# EAGLE design STM32_CAN-USB (EAGLE 7.2.0)
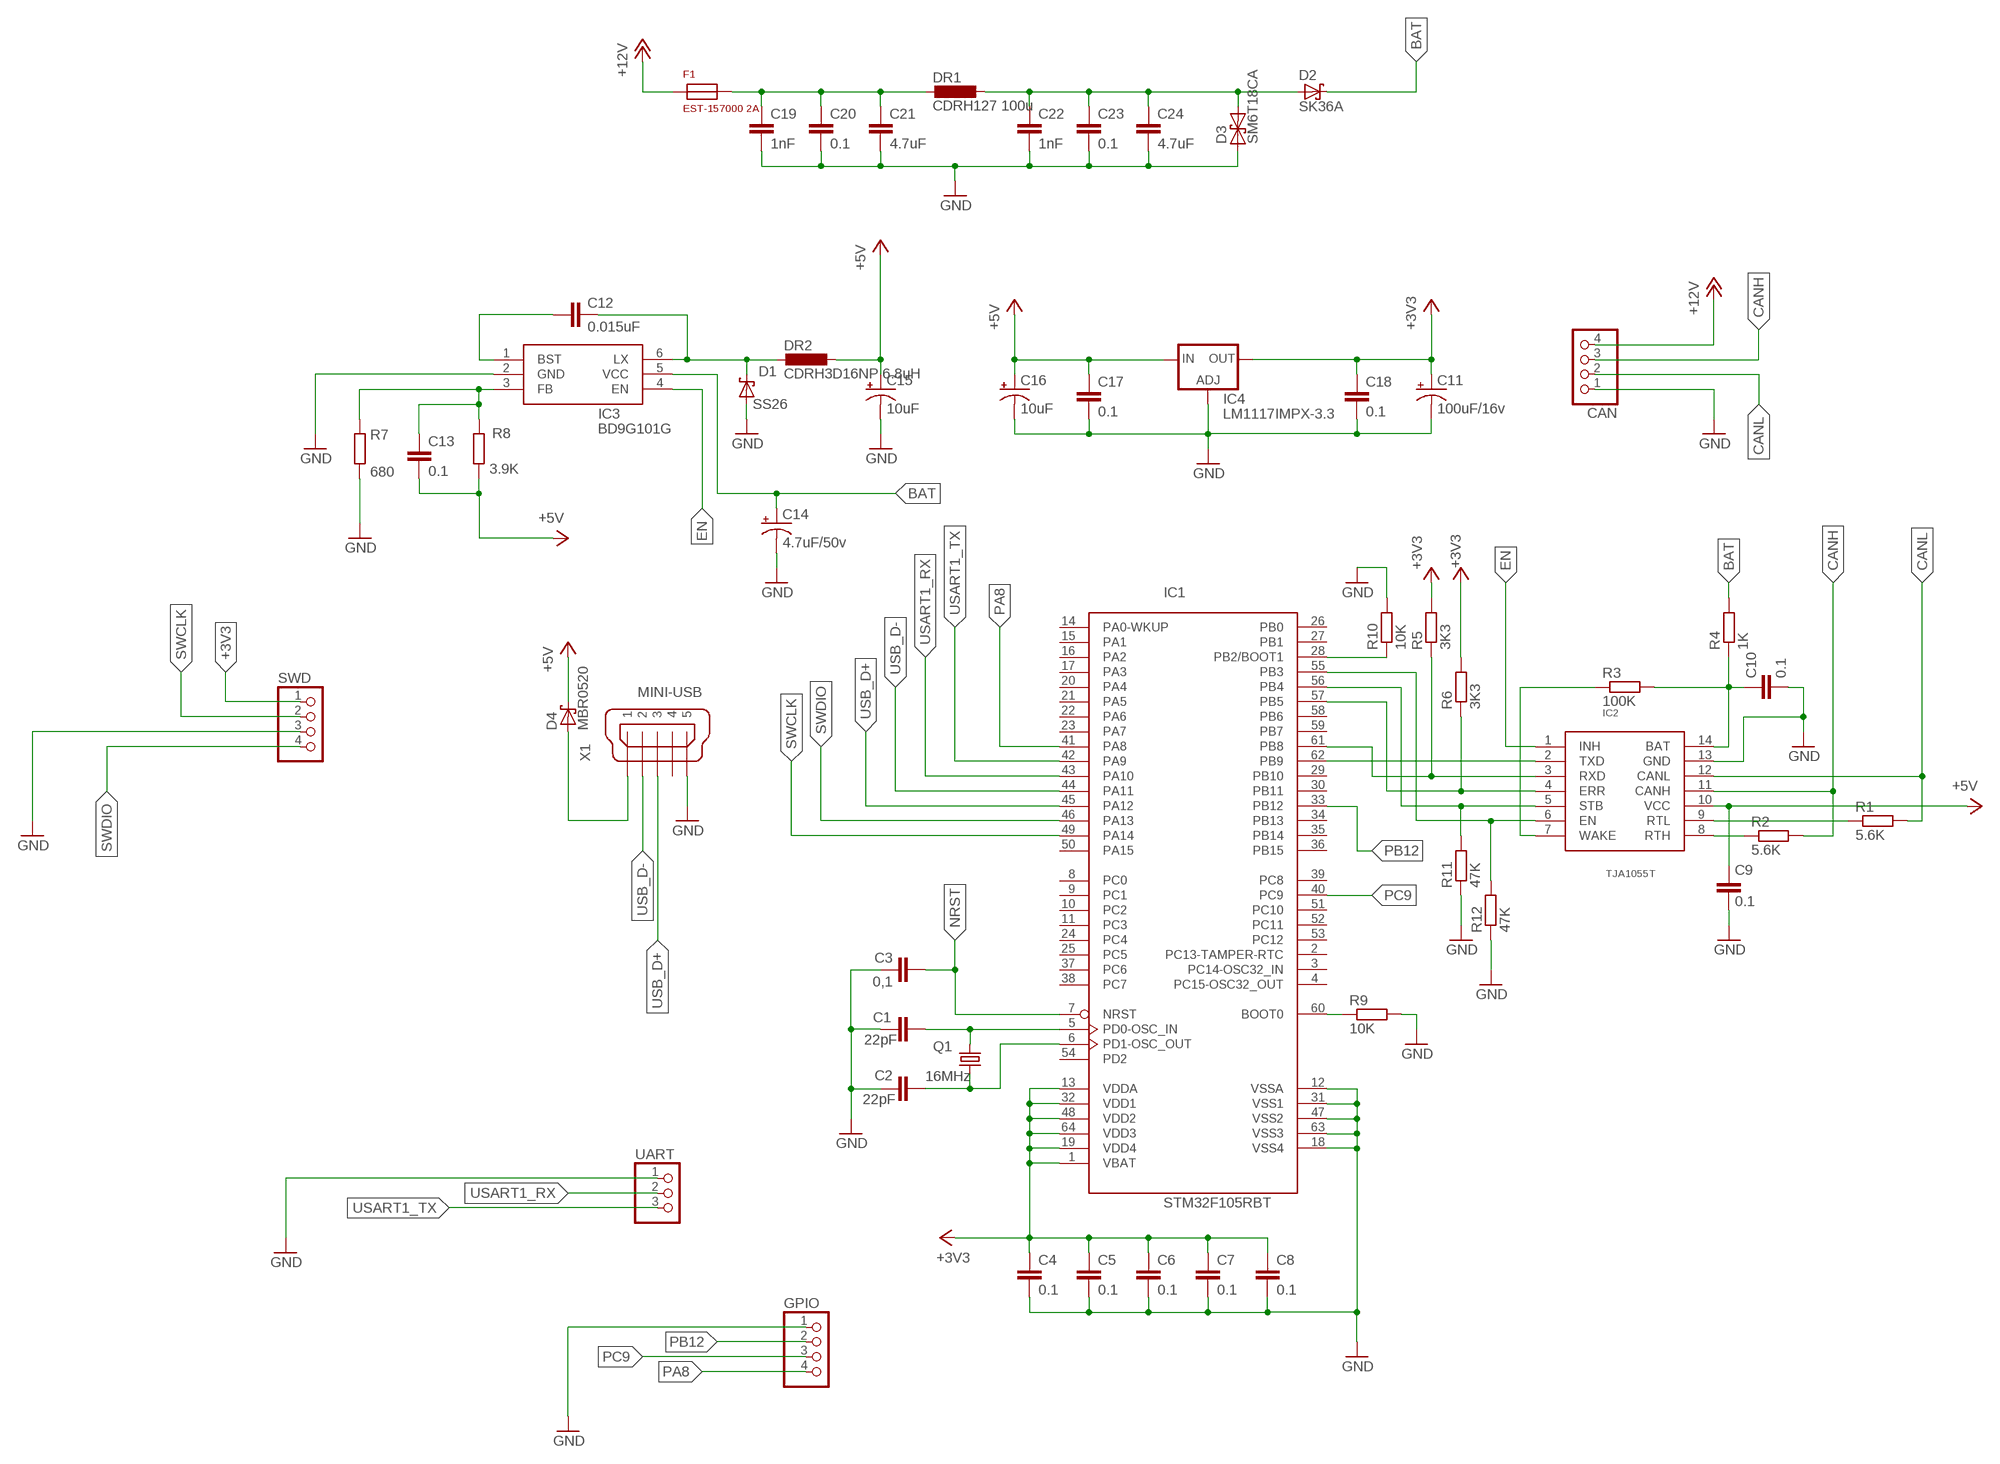
[diagram p0: schematic, sheet 1]

## Parts
C1  22pF  C-EUC0805  [C0805]
C2  22pF  C-EUC0805  [C0805]
C3  0,1  C-EUC0805  [C0805]
C4  0.1  C-EUC0805  [C0805]
C5  0.1  C-EUC0805  [C0805]
C6  0.1  C-EUC0805  [C0805]
C7  0.1  C-EUC0805  [C0805]
C8  0.1  C-EUC0805  [C0805]
C9  0.1  C-EUC0805  [C0805]
C10  0.1  C-EUC0805  [C0805]
C11  100uF/16v  CPOL-US153CLV-0605  [153CLV-0605]
C12  0.015uF  C-EUC0805  [C0805]
C13  0.1  C-EUC0805  [C0805]
C14  4.7uF/50v  CPOL-US153CLV-0605  [153CLV-0605]
C15  10uF  CPOL-US153CLV-0605  [153CLV-0605]
C16  10uF  CPOL-US153CLV-0605  [153CLV-0605]
C17  0.1  C-EUC0805  [C0805]
C18  0.1  C-EUC0805  [C0805]
C19  1nF  C-EUC0805  [C0805]
C20  0.1  C-EUC0805  [C0805]
C21  4.7uF  C-EUC0805  [C0805]
C22  1nF  C-EUC0805  [C0805]
C23  0.1  C-EUC0805  [C0805]
C24  4.7uF  C-EUC0805  [C0805]
CAN  PINHD-1X4  [1X04]
D1  SS26  SCHOTTKY-DIODESMD  [SMB]
D2  SK36A  [DO-214AC]
D3  SM6T18CA  [DO214AA]
D4  MBR0520  [SOD123]
DR1  CDRH127 100u  CDRH127  [MS85]
DR2  CDRH3D16NP 6.8uH  CDRH3D16NP  [CDRH3D16NP]
F1  EST-157000 2A  FUSE  [FUSE]
GPIO  PINHD-1X4  [1X04]
IC1  STM32F105RBT  [LQFP64]
IC2  TJA1055T  TJA1054T  [SO-14W]
IC3  BD9G101G  [SSOP6]
IC4  LM1117IMPX-3.3  [SOT223]
Q1  16MHz  CRYSTALHC49UP  [HC49UP]
R1  5.6K  R-EU_R0805  [R0805]
R2  5.6K  R-EU_R0805  [R0805]
R3  100K  R-EU_R0805  [R0805]
R4  1K  R-EU_R0805  [R0805]
R5  3K3  R-EU_R0805  [R0805]
R6  3K3  R-EU_R0805  [R0805]
R7  680  R-EU_R0805  [R0805]
R8  3.9K  R-EU_R0805  [R0805]
R9  10K  R-EU_R0805  [R0805]
R10  10K  R-EU_R0805  [R0805]
R11  47K  R-EU_R0805  [R0805]
R12  47K  R-EU_R0805  [R0805]
SWD  PINHD-1X4  [1X04]
UART  PINHD-1X3  [1X03]
X1  MINI-USB  MINI-USB-UX60-MB-5ST  [UX60-MB-5ST]

## Nets
+3V3: C4.1 C5.1 C6.1 C7.1 C8.1 C11.+ C18.1 IC1.1(VBAT) IC1.13(VDDA) IC1.19(VDD4) IC1.32(VDD1) IC1.48(VDD2) IC1.64(VDD3) IC4.2(OUT) IC4.4(OUT) R5.2 R6.2 SWD.1
+5V: C9.1 C13.2 C15.+ C16.+ C17.1 D4.C DR2.P$2 IC2.10(VCC) IC4.3(IN) R8.1
+12V: CAN.4 F1.P$1
BAT: C14.+ D2.C IC3.5(VCC) R4.2
CANH: CAN.3 IC2.11(CANH) R2.2
CANL: CAN.2 IC2.12(CANL) R1.2
EN: IC2.1(INH) IC3.4(EN)
GND: C1.2 C2.2 C3.1 C4.2 C5.2 C6.2 C7.2 C8.2 C9.2 C10.2 C11.- C14.- C15.- C16.- C17.2 C18.2 C19.2 C20.2 C21.2 C22.2 C23.2 C24.2 CAN.1 D1.A D3.A GPIO.1 IC1.12(VSSA) IC1.18(VSS4) IC1.31(VSS1) IC1.47(VSS2) IC1.63(VSS3) IC2.13(GND) IC3.2(GND) IC4.1(ADJ) R7.1 R9.2 R10.2 R11.1 R12.1 SWD.3 UART.1 X1.5 X1.M1 X1.M2
N$1: C1.1 IC1.5(PD0-OSC_IN) Q1.2
N$2: C2.1 IC1.6(PD1-OSC_OUT) Q1.1
N$3: IC1.60(BOOT0) R9.1
N$4: IC1.61(PB8) IC2.3(RXD) R5.1
N$5: IC1.62(PB9) IC2.2(TXD)
N$6: IC1.56(PB4) IC2.5(STB) R11.2
N$7: IC2.8(RTH) R2.1
N$8: IC2.9(RTL) R1.1
N$9: C12.1 IC3.1(BST)
N$10: IC2.7(WAKE) R3.1
N$11: C10.1 IC2.14(BAT) R3.2 R4.1
N$12: C12.2 D1.C DR2.P$1 IC3.6(LX)
N$13: C13.1 IC3.3(FB) R7.2 R8.2
N$14: IC1.55(PB3) IC2.6(EN) R12.2
N$15: IC1.57(PB5) IC2.4(ERR) R6.1
N$16: IC1.28(PB2/BOOT1) R10.1
N$17: C22.1 C23.1 C24.1 D2.A D3.C DR1.P$2
N$18: C19.1 C20.1 C21.1 DR1.P$1 F1.P$2
N$19: D4.A X1.1
NRST: C3.2 IC1.7(NRST)
PA8: GPIO.4 IC1.41(PA8)
PB12: GPIO.2 IC1.33(PB12)
PC9: GPIO.3 IC1.40(PC9)
SWCLK: IC1.49(PA14) SWD.2
SWDIO: IC1.46(PA13) SWD.4
USART1_RX: IC1.43(PA10) UART.2
USART1_TX: IC1.42(PA9) UART.3
USB_D+: IC1.45(PA12) X1.3
USB_D-: IC1.44(PA11) X1.2
Unconnected: IC1.2(PC13-TAMPER-RTC) IC1.3(PC14-OSC32_IN) IC1.4(PC15-OSC32_OUT) IC1.8(PC0) IC1.9(PC1) IC1.10(PC2) IC1.11(PC3) IC1.14(PA0-WKUP) IC1.15(PA1) IC1.16(PA2) IC1.17(PA3) IC1.20(PA4) IC1.21(PA5) IC1.22(PA6) IC1.23(PA7) IC1.24(PC4) IC1.25(PC5) IC1.26(PB0) IC1.27(PB1) IC1.29(PB10) IC1.30(PB11) IC1.34(PB13) IC1.35(PB14) IC1.36(PB15) IC1.37(PC6) IC1.38(PC7) IC1.39(PC8) IC1.50(PA15) IC1.51(PC10) IC1.52(PC11) IC1.53(PC12) IC1.54(PD2) IC1.58(PB6) IC1.59(PB7) X1.4

## Library data of the parts
C1-C10 C12 C13 C17-C24 = rcl:C-EU: CAPACITOR, European symbol
C11 C14-C16 = rcl:CPOL-US: POLARIZED CAPACITOR, American symbol
CAN GPIO SWD = pinhead:PINHD-1X4: PIN HEADER
D1 = STM32_CAN-USB:SCHOTTKY-DIODE: Schottky Diode
D2 = STM32_CAN-USB:SK36A
D3 = STM32_CAN-USB:SM6T18CA
D4 = STM32_CAN-USB:MBR0520
DR1 = STM32_CAN-USB:CDRH127
DR2 = STM32_CAN-USB:CDRH3D16NP
F1 = STM32_CAN-USB:FUSE
IC1 = STM32_CAN-USB:STM32F105R*T: ARM 32-bit Cortex™-M3 CPU 72 MHz maximum frequency 64 to 256 Kbytes of Flash memory 64 kbytes of SRAM 51 GPIOs 2.0 to 3.6 V application supply
IC2 = STM32_CAN-USB:TJA1054T
IC3 = STM32_CAN-USB:BD9G101G
IC4 = STM32_CAN-USB:LM1117IMPX-3.3
Q1 = crystal:CRYSTAL: CRYSTAL; OC_FARNELL: unknown; OC_NEWARK: unknown
R1-R12 = rcl:R-EU_: RESISTOR, European symbol
UART = pinhead:PINHD-1X3: PIN HEADER
X1 = STM32_CAN-USB:MINI-USB-: MINI USB Connector Source: http://www.hirose.co.jp/cataloge_hp/e24000019.pdf; OC_FARNELL: unknown; OC_NEWARK: unknown

## Board
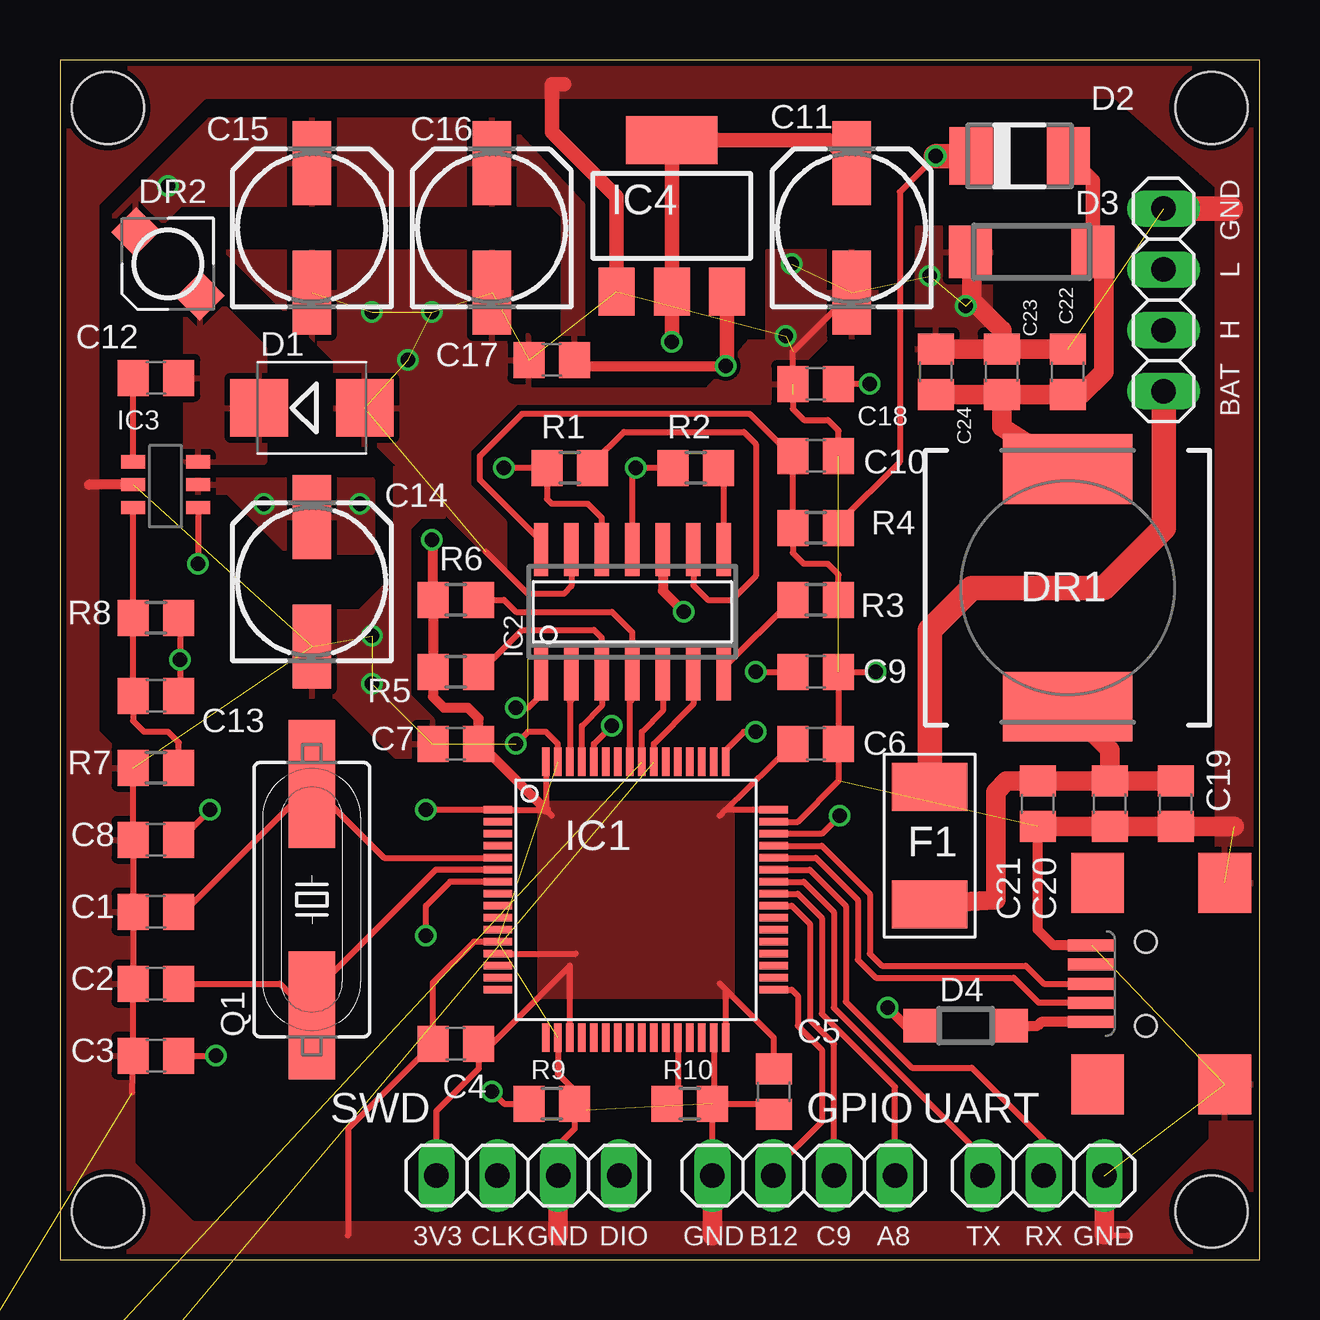
[diagram p1: board, top side]
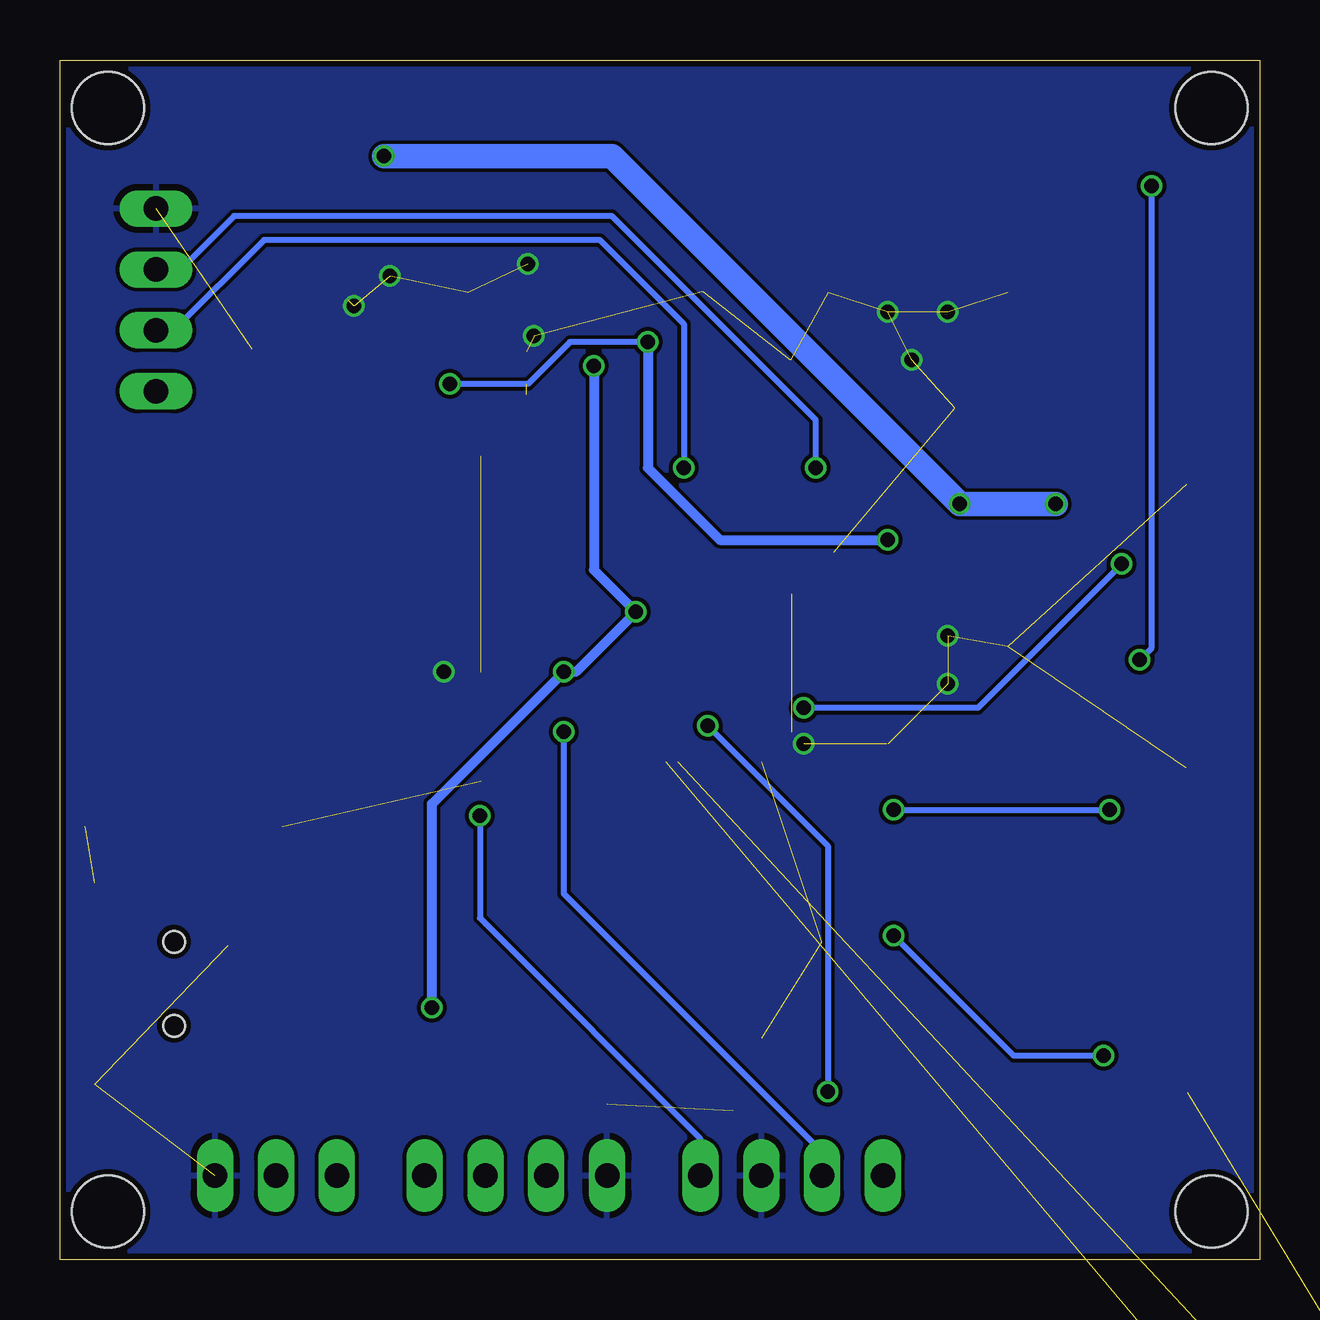
[diagram p2: board, bottom side, seen from below]

Size 50 x 50 mm. Coordinates in mm from the lower left corner, seen from the top.
Outline: 0,0 50,0 50,50 0,50 0,0
Copper layers (1*16): Top 0.035mm / dielectric 1.5mm / Bottom 0.035mm
Design rules "ITEADstudio_DRC": minimum track width 6mil, minimum drill 12mil, track to track 6mil, track to pad 6mil, pad to pad 6mil, via to via 6mil, smd to smd 0mil, copper to edge 10mil, drill to drill 10mil, minimum pad ring 10mil, minimum via ring 6mil, stop-mask expansion 2mil, vias tented up to drill 100mil, thermal gap 10mil
Holes 3 mm at 2,2 2,48 48,48 48,2

### Footprints (pad centres in the part's own frame; a part is rotated, then mirrored left to right if it is on the bottom)
C0805 = smd 1.3 x 1.5: 1 -0.95,0; 2 0.95,0
153CLV-0605 = smd 3.5 x 1.6: + 2.7,0; - -2.7,0
1X04 = drill 1.016 long: 1 -3.81,0; 2 -1.27,0; 3 1.27,0; 4 3.81,0
SMB = smd 2.4 x 2.4: A 2.2,0; C -2.2,0
DO-214AC = smd 1.8 x 2.4: A 2.025,0; C -2.025,0
DO214AA = smd 1.8 x 2.2: A 2.55,0; C -2.55,0
SOD123 = smd 1.4 x 1.4: A 1.9,0; C -1.9,0
MS85 = smd 5.4 x 2.9: P$1 0,4.95; P$2 0,-4.95
CDRH3D16NP = smd 1.5 x 1.4 rotated 45: P$1 -1.349,1.349; P$2 1.349,-1.349
FUSE = smd 2 x 3.15: P$1 -2.45,0; P$2 2.45,0
LQFP64 = smd 1.2 x 0.3: 1 -5.75,3.75; 2 -5.75,3.25; 3 -5.75,2.75; 4 -5.75,2.25; 5 -5.75,1.75; 6 -5.75,1.25; 7 -5.75,0.75; 8 -5.75,0.25; 9 -5.75,-0.25; 10 -5.75,-0.75; 11 -5.75,-1.25; 12 -5.75,-1.75; 13 -5.75,-2.25; 14 -5.75,-2.75; 15 -5.75,-3.25; 16 -5.75,-3.75; 33 5.75,-3.75; 34 5.75,-3.25; 35 5.75,-2.75; 36 5.75,-2.25; 37 5.75,-1.75; 38 5.75,-1.25; 39 5.75,-0.75; 40 5.75,-0.25; 41 5.75,0.25; 42 5.75,0.75; 43 5.75,1.25; 44 5.75,1.75; 45 5.75,2.25; 46 5.75,2.75; 47 5.75,3.25; 48 5.75,3.75 | smd 0.3 x 1.2: 17 -3.75,-5.75; 18 -3.25,-5.75; 19 -2.75,-5.75; 20 -2.25,-5.75; 21 -1.75,-5.75; 22 -1.25,-5.75; 23 -0.75,-5.75; 24 -0.25,-5.75; 25 0.25,-5.75; 26 0.75,-5.75; 27 1.25,-5.75; 28 1.75,-5.75; 29 2.25,-5.75; 30 2.75,-5.75; 31 3.25,-5.75; 32 3.75,-5.75; 49 3.75,5.75; 50 3.25,5.75; 51 2.75,5.75; 52 2.25,5.75; 53 1.75,5.75; 54 1.25,5.75; 55 0.75,5.75; 56 0.25,5.75; 57 -0.25,5.75; 58 -0.75,5.75; 59 -1.25,5.75; 60 -1.75,5.75; 61 -2.25,5.75; 62 -2.75,5.75; 63 -3.25,5.75; 64 -3.75,5.75
SO-14W = smd 0.6 x 2.2: 1 -3.81,-2.6; 2 -2.54,-2.6; 3 -1.27,-2.6; 4 0,-2.6; 5 1.27,-2.6; 6 2.54,-2.6; 7 3.81,-2.6; 8 3.81,2.6; 9 2.54,2.6; 10 1.27,2.6; 11 0,2.6; 12 -1.27,2.6; 13 -2.54,2.6; 14 -3.81,2.6
SSOP6 = smd 0.55 x 1: 1 0,-2.7; 2 0.95,-2.7; 3 1.9,-2.7; 4 1.9,0; 5 0.95,0; 6 0,0
SOT223 = smd 1.5 x 2: 1 -2.3,-3.15; 2 0,-3.15; 3 2.3,-3.15 | smd 3.8 x 2: 4 0,3.15
HC49UP = smd 5.334 x 1.93: 1 -4.826,0; 2 4.826,0
R0805 = smd 1.3 x 1.5: 1 -0.95,0; 2 0.95,0
1X03 = drill 1.016 long: 1 -2.54,0; 2 0,0; 3 2.54,0
UX60-MB-5ST = smd 2 x 0.5: 1 2.25,1.6; 2 2.25,0.8; 3 2.25,0; 4 2.25,-0.8; 5 2.25,-1.6 | smd 2.2 x 2.5: M1 -3.3,-4.2; M2 -3.3,4.2; M3 2,4.2; M4 2,-4.2 | hole 0.9: 0,-1.75; 0,1.75

### Placement (x,y rotation side)
C1  4,14.5 180 top
C2  4,11.5 180 top
C3  4,8.5 0 top
C4  16.5,9 180 top
C5  29.75,7 270 top
C6  31.5,21.5 0 top
C7  16.5,21.5 180 top
C8  4,17.5 180 top
C9  31.5,24.5 0 top
C10  31.5,33.5 0 top
C11  33,43 90 top
C12  4,36.75 0 top
C13  4,23.5 0 top
C14  10.5,28.25 90 top
C15  10.5,43 90 top
C16  18,43 90 top
C17  20.5,37.5 180 top
C18  31.5,36.5 180 top
C19  46.5,19 270 top
C20  43.75,19 270 top
C21  40.75,19 270 top
C22  42,37 90 top
C23  39.25,37 90 top
C24  36.5,37 90 top
CAN  46,40 270 top
D1  10.5,35.5 0 top
D2  40,46 0 top
D3  40.5,42 180 top
D4  37.75,9.75 0 top
DR1  42,28 180 top
DR2  4.5,41.5 180 top
F1  36.25,17.25 270 top
GPIO  31,3.5 0 top
IC1  24,15 0 top
IC2  23.86,27 0 top
IC3  5.75,33.25 270 top
IC4  25.5,43.5 0 top
Q1  10.5,15 90 top
R1  21.25,33 180 top
R2  26.5,33 180 top
R3  31.5,27.5 0 top
R4  31.5,30.5 0 top
R5  16.5,24.5 180 top
R6  16.5,27.5 180 top
R7  4,20.5 0 top
R8  4,26.75 180 top
R9  20.5,6.5 0 top
R10  26.25,6.5 0 top
R11  -8.5,-13.5 0 top  (outside the outline)
R12  -8.5,-17.5 0 top  (outside the outline)
SWD  19.5,3.5 0 top
UART  41,3.5 180 top
X1  45.25,11.5 180 top

### Tracks (layer width: path | path; a pad name or v marks a point on that pad's centre or on a via)
+3V3  (via drill 0.6)
  Top 0.254: IC1.32 27.75,11.25 | 27.75,11.25 27.5,11.5 | C6.1 27.75,18.75 | 27.75,18.75 27.5,18.5 | IC1.48 27.75,18.75 | C7.1 17.5,21.5 | IC1.64 20.25,18.75 | 20.25,18.75 IC1.1 v15.25,18.75 | 20.25,18.75 20.5,18.5 | IC1.13 21.5,12.75 | IC1.19 21.25,12.25 17.5,8.5 C4.1 17.45,7.95 15.69,6.19 SWD.1 | v6.25,18.75 5,17.5 C8.1 | 15.55,29.95 v15.5,30 | C5.1 29.75,9.25 27.75,11.25 | v33.75,36.5 C18.1
  Top 0.406: 17.5,21.5 20.25,18.75 | 15.55,29.95 R6.2 R5.2 15.55,23.45 16,23 17,23 17.45,22.55 C7.1
  Top 0.61: v25.5,38.25 IC4.2 IC4.4 32.05,46.65 C11.+
  Bottom 0.254: v15.25,18.75 v6.25,18.75 | v25.5,38.25 28.75,38.25 30.5,36.5 v33.75,36.5
  Bottom 0.406: v25.5,38.25 25.5,33 22.5,30 v15.5,30
  pour Top: 28,19 20,19 20,11 28,11
+5V  (via drill 0.6)
  Top 0.254: v29,24.5 C9.1 | v27.75,37.25 27.8,37.3 | R8.1 5,26.7 v5,25 5,23.55 C13.2 | C17.1 21.7,37.25
  Top 0.406: IC2.10 25.13,27.87 v26,27 | 21.7,37.25 v27.75,37.25 | D4.C 35.25,9.75 v34.5,10.5
  Top 0.61: 27.8,37.3 IC4.3
  Bottom 0.254: v5,25 4.5,25.5 v4.5,44.75
  Bottom 0.406: v27.75,37.25 27.75,28.75 v26,27 28.5,24.5 v29,24.5 34.5,19 v34.5,10.5
  pour Top: 2.25,43.5 6.25,47.5 18.5,47.5 21.75,44 21.75,37.5 21,37.5 21,43.5 20.5,44 5,44 3,42
+12V
  Top 1.016: F1.P$1 36.25,26.25 38,28 43.5,28 46,30.5 CAN.4
BAT  (via drill 0.6)
  Top 0.254: v36.5,46 35,44.5 35,33.25 32.45,30.7 R4.2
  Top 1.016: D2.C v36.5,46
  Bottom 1.016: v36.5,46 27,46 v12.5,31.5 v8.5,31.5
  pour Top: 5.5,32.5 13,32.5 13,29.5 9.5,29.5 7,32 5.5,32
CANH  (via drill 0.6)
  Top 0.254: R2.2 v24,33 23.86,32.86 IC2.11
  Bottom 0.254: v24,33 24,39 27.5,42.5 41.5,42.5 45.27,38.73 CAN.3
CANL  (via drill 0.6)
  Top 0.254: IC2.12 22.59,30.91 22,31.5 20.5,31.5 20.3,31.7 R1.2 v18.5,33
  Bottom 0.254: v18.5,33 18.5,35 27,43.5 42.75,43.5 45,41.25 45.98,41.25 CAN.2
EN  (via drill 0.6)
  Top 0.254: IC3.4 v5.75,29 | 20.05,24.05 IC2.1 20,24.35 20,23.5 19.5,23 v19,23
  Bottom 0.254: v5.75,29 11.75,23 v19,23
GND  (via drill 0.6)  (33 unrouted)
  Top 0.254: IC1.47 30.75,18.25 32.45,19.95 C6.2 C9.2 | IC1.12 17.25,13.25 15.55,11.55 C4.2 12,5.45 12,1 | 3,7 3,6.95 C3.1 C2.2 C1.2 C8.2 R7.1 | IC2.13 21.32,28.07 21,27.75 19.5,27.75 17.75,29.5 | C9.2 32.5,24.5 | 32.5,33.5 C10.2 32.45,34.55 32,35 31,35 30.55,35.45 C18.2 30.55,37.85 C11.- | IC1.63 20.75,21.5 20.25,22 19.5,22 v19,21.5 | 30.55,36.05 30.5,36 | C7.2 15.5,21.5 | R10.2 29.3,6.5 C5.2 | 43.54,1.04 44.5,1 | C9.2 v34,24.5 | 21.95,6.22 R9.2 | R10.2 27.25,5.95 27.19,5.89 GPIO.1 | IC1.18 20.75,7.75 21.45,7.05 R9.2 | SWD.3 20.77,4.77 21.45,5.45 R9.2 | IC1.31 27.25,6.55 R10.2
  Top 0.406: IC3.2 1.2,32.3 | X1.5 41.4,13.1 40.75,13.75 C21.2 | 38,42.45 D3.A
  Top 0.61: IC4.1 23.2,44.3 20.5,47 20.5,49 21,49 | 38,42.05 D3.A
  Top 0.813: C21.2 C20.2 C19.2 48.95,18.05 | C24.2 C23.2 | C22.2 C23.2 | C23.2 39.25,38.75 38,40 38,41.95 D3.A | UART.1 43.54,1.04 | SWD.3 20.77,1 | GPIO.1 27.19,1
  Top 1.016: CAN.1 48.81,43.81
  other vias: 13,39.5 15.5,39.5 14.5,37.5 30.5,41.5 30.25,38.5 36.25,41 37.75,39.75 13,26 13,24
  pour Top: 18.5,28.75 13.25,34 11.5,34 11.5,37.5 7,42 19,42 18.5,38.5 19.5,38.5 19.5,36 19,35.75 17,33.75 17,32.25 18.5,30.75
  pour Top: 14,33 16,31 15,31 14.5,30.5 14.5,23.5 15.5,22.5 15.5,21 14,21 11.5,23.5 10,23.5 10,27 12.5,27 14,28.5
  pour Top: 52,7 48.25,7 48.25,44.75 44,48.5 6,48.5 1.5,44 1.5,22 3,20.5 3,4 5.5,1.5 44.5,1.5 48,5 48,6.5 52,6.5 52,-1 -2,-1 -2.5,51.5 52,51.5
  pour Bottom: -10,54.5 54.5,54.5 54.5,-10 -9.5,-10
  pour Top: 34,38.5 34,42 29.5,42 29.5,36 31,36 31,37.5 32,38.5
  pour Top: 35.75,37.75 35.75,43 38.75,43 38.75,39.25 39.25,38.75 39.25,37.75
  pour Top: 30,35.75 18.5,35.75 18.5,36.25 27,36.25 28.75,38.25 30,38.25
N$1
  Top 0.254: C1.1 5.17,14.5 Q1.2 10.5,19.75 13.5,16.75 IC1.5
N$2
  Top 0.254: IC1.6 15.66,16.25 10.5,11.09 Q1.1 9.17,11.5 C2.1
N$3  (via drill 0.6)
  Top 0.254: IC1.60 22.25,21.5 v23,22.25 | v18,7 18.5,6.5 R9.1
  Bottom 0.254: v18,7 18,17.25 v23,22.25
N$4
  Top 0.254: IC1.61 21.75,22.25 22.59,23.09 IC2.3 22.59,25.91 22.25,26.25 19.25,26.25 17.5,24.5 R5.1
N$5
  Top 0.254: IC2.2 21.32,23.32 21.25,23.25 IC1.62
N$6  (1 unrouted)
  Top 0.254: IC2.5 25.13,22.88 24.25,22 IC1.56
N$7
  Top 0.254: IC2.8 27.67,32.78 R2.1
N$8
  Top 0.254: IC2.9 26.4,28.1 27,27.5 28,27.5 29,28.5 29,34 28.5,34.5 23.5,34.5 22.2,33.2 R1.1
N$9
  Top 0.254: IC3.1 C12.1
N$10
  Top 0.254: R3.1 30.5,27.5 27.67,24.67 IC2.7
N$11
  Top 0.254: IC2.14 20.05,29.95 17.5,32.5 17.5,33.5 19.25,35.25 28.75,35.25 30.5,33.5 C10.1 R4.1 30.55,29.45 31,29 32,29 32.45,28.55 R3.2
N$12
  pour Top: 5.25,33.25 5.25,40.25 6.25,40.25 8.5,38 8.5,33.25
N$13
  Top 0.254: R7.2 4.95,21.55 4.5,22 3.5,22 3.05,22.45 C13.1 R8.2 IC3.3
N$14  (1 unrouted)
  Top 0.254: IC2.6 26.4,23.15 24.75,21.5 IC1.55
N$15
  Top 0.254: R6.1 18.5,27.5 19,27 23,27 23.86,26.14 IC2.4 23.86,23.36 23.75,23.25 IC1.57
N$16
  Top 0.254: IC1.28 25.75,7.05 R10.1
N$17
  Top 0.61: D2.A 43.05,44.98 D3.C 43.55,42.45
  Top 0.813: C24.1 C23.1 | C23.1 C22.1 42.55,36.05 43.5,37 43.5,41.55 D3.C | C23.1 39.25,34.7 DR1.P$2
N$18
  Top 0.813: C20.1 C21.1 39.45,19.95 39,19.5 39,15 35.8,14.8 | C20.1 C19.1 | C20.1 43.75,21.25 42,23 41.05,23 DR1.P$1
  Top 1.016: F1.P$2 35.8,14.8
N$19
  Top 0.406: X1.1 40.9,9.9 40.75,9.75 D4.A
NRST  (via drill 0.6)
  Top 0.254: IC1.7 16.25,15.75 15.25,14.75 v15.25,13.5 | C3.2 v6.5,8.5
  Bottom 0.254: v6.5,8.5 10.25,8.5 v15.25,13.5
PA8
  Top 0.254: IC1.41 30.75,15.25 31.75,14.25 31.75,10.25 34.81,7.19 GPIO.4
PB12
  Top 0.254: IC1.33 30.5,11.25 30.75,11 30.75,9.75 31.75,8.75 31.75,5.75 29.71,3.71 29.71,3.52 GPIO.2
PC9
  Top 0.254: IC1.40 30.5,14.75 31.25,14 31.25,10 32.27,8.98 GPIO.3
SWCLK  (via drill 0.6)
  Top 0.254: v29,22 28.5,22 27.75,21.25 IC1.49
  Bottom 0.254: v29,22 29,15.25 18.23,4.48 SWD.2
SWDIO  (via drill 0.6)
  Top 0.254: v32.5,18.5 31.75,17.75 IC1.46
  Bottom 0.254: SWD.4 23.31,5.04 32.25,13.98 32.5,14.23 v32.5,18.5
USART1_RX
  Top 0.254: IC1.43 31.25,16.25 32.75,14.75 32.75,10.75 35.5,8 38,8 41,5 UART.2
USART1_TX
  Top 0.254: IC1.42 31,15.75 32.25,14.5 32.25,10.5 38.46,4.29 UART.3
USB_D+
  Top 0.254: IC1.45 31.75,17.25 33.75,15.25 33.75,12.75 34.25,12.25 40.25,12.25 41,11.5 X1.3
USB_D-
  Top 0.254: IC1.44 31.5,16.75 33.25,15 33.25,12.5 34,11.75 39.75,11.75 40.8,10.7 X1.2

### Text on the board
tNames: GND | L | H | BAT | 3V3 | CLK | GND | DIO | GND | B12 | C9 | A8 | TX | RX | GND